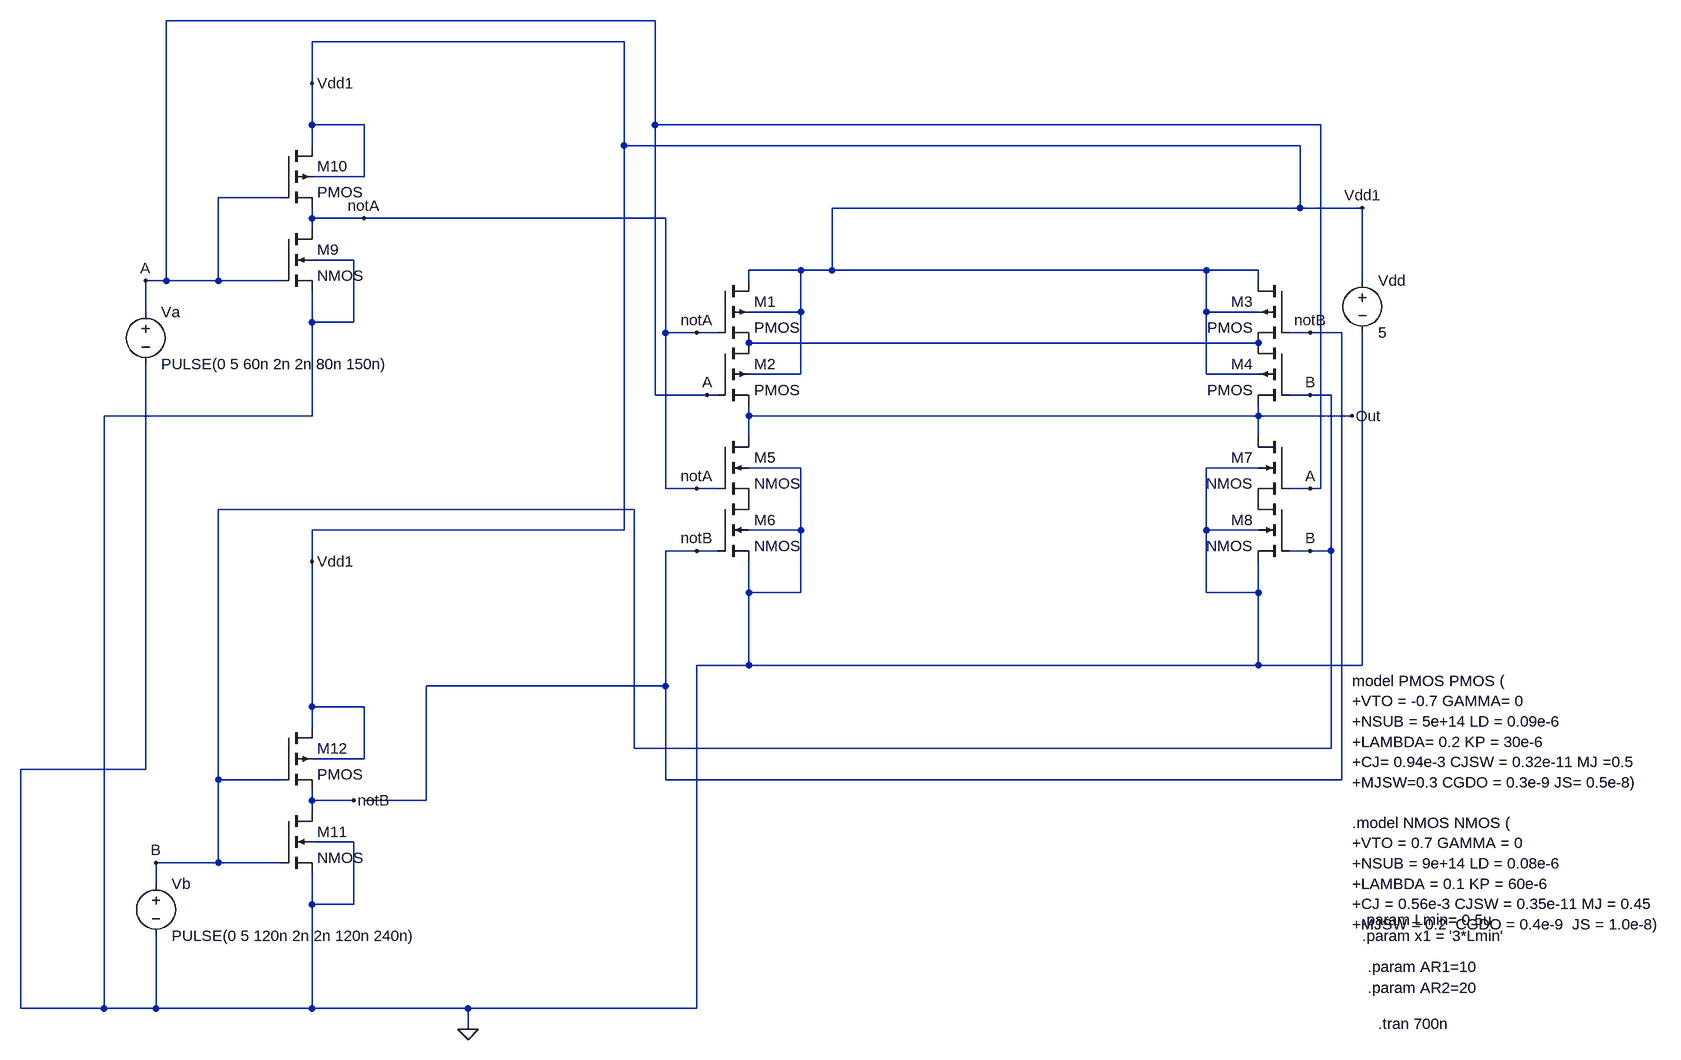
[diagram p0: schematic XOR.asc]
XOR.asc, the LTspice schematic file:
Version 4
SHEET 1 2156 1524
WIRE 576 -336 -176 -336
WIRE 528 -304 48 -304
WIRE 48 -240 48 -304
WIRE 48 -176 48 -240
WIRE 128 -176 48 -176
WIRE 576 -176 576 -336
WIRE 1600 -176 576 -176
WIRE 48 -144 48 -176
WIRE 528 -144 528 -304
WIRE 1568 -144 528 -144
WIRE 128 -96 128 -176
WIRE 128 -96 48 -96
WIRE 0 -64 -96 -64
WIRE 1568 -48 1568 -144
WIRE 1568 -48 848 -48
WIRE 1664 -48 1568 -48
WIRE 48 -32 48 -48
WIRE 128 -32 48 -32
WIRE 592 -32 128 -32
WIRE 48 -16 48 -32
WIRE 112 32 48 32
WIRE 800 48 720 48
WIRE 848 48 848 -48
WIRE 848 48 800 48
WIRE 1424 48 848 48
WIRE 1504 48 1424 48
WIRE -176 64 -176 -336
WIRE -176 64 -208 64
WIRE -96 64 -96 -64
WIRE -96 64 -176 64
WIRE 0 64 -96 64
WIRE 720 64 720 48
WIRE 1504 64 1504 48
WIRE 1664 64 1664 -48
WIRE -208 112 -208 64
WIRE 800 112 800 48
WIRE 800 112 720 112
WIRE 1424 112 1424 48
WIRE 1504 112 1424 112
WIRE 48 128 48 80
WIRE 112 128 112 32
WIRE 112 128 48 128
WIRE 592 144 592 -32
WIRE 640 144 592 144
WIRE 672 144 640 144
WIRE 1584 144 1552 144
WIRE 1632 144 1584 144
WIRE 1504 160 720 160
WIRE 800 208 800 112
WIRE 800 208 720 208
WIRE 1424 208 1424 112
WIRE 1504 208 1424 208
WIRE 576 240 576 -176
WIRE 656 240 576 240
WIRE 672 240 656 240
WIRE 1584 240 1552 240
WIRE 1616 240 1584 240
WIRE 48 272 48 128
WIRE 48 272 -272 272
WIRE 720 272 720 256
WIRE 1504 272 1504 256
WIRE 1504 272 720 272
WIRE 1648 272 1504 272
WIRE 720 304 720 272
WIRE 1504 304 1504 272
WIRE 800 352 720 352
WIRE 1504 352 1424 352
WIRE 592 384 592 144
WIRE 640 384 592 384
WIRE 672 384 640 384
WIRE 1584 384 1552 384
WIRE 1600 384 1600 -176
WIRE 1600 384 1584 384
WIRE 544 416 -96 416
WIRE 528 448 528 -144
WIRE 528 448 48 448
WIRE 800 448 800 352
WIRE 800 448 720 448
WIRE 1424 448 1424 352
WIRE 1504 448 1424 448
WIRE 640 480 592 480
WIRE 672 480 640 480
WIRE 1584 480 1552 480
WIRE 1616 480 1616 240
WIRE 1616 480 1584 480
WIRE 48 496 48 448
WIRE 720 544 720 496
WIRE 800 544 800 448
WIRE 800 544 720 544
WIRE 1424 544 1424 448
WIRE 1504 544 1504 496
WIRE 1504 544 1424 544
WIRE 720 656 720 544
WIRE 720 656 640 656
WIRE 1504 656 1504 544
WIRE 1504 656 720 656
WIRE 1664 656 1664 144
WIRE 1664 656 1504 656
WIRE 592 688 592 480
WIRE 592 688 224 688
WIRE 48 720 48 496
WIRE 128 720 48 720
WIRE 48 752 48 720
WIRE 544 784 544 416
WIRE 1616 784 1616 480
WIRE 1616 784 544 784
WIRE 128 800 128 720
WIRE 128 800 48 800
WIRE -208 816 -208 192
WIRE -208 816 -400 816
WIRE -96 832 -96 416
WIRE 0 832 -96 832
WIRE 592 832 592 688
WIRE 1632 832 1632 144
WIRE 1632 832 592 832
WIRE 48 864 48 848
WIRE 112 864 48 864
WIRE 224 864 224 688
WIRE 224 864 128 864
WIRE 48 880 48 864
WIRE 112 928 48 928
WIRE -96 960 -96 832
WIRE -96 960 -192 960
WIRE 0 960 -96 960
WIRE -192 992 -192 960
WIRE 48 1024 48 976
WIRE 112 1024 112 928
WIRE 112 1024 48 1024
WIRE -400 1184 -400 816
WIRE -272 1184 -272 272
WIRE -272 1184 -400 1184
WIRE -192 1184 -192 1072
WIRE -192 1184 -272 1184
WIRE 48 1184 48 1024
WIRE 48 1184 -192 1184
WIRE 288 1184 48 1184
WIRE 640 1184 640 656
WIRE 640 1184 288 1184
WIRE 288 1216 288 1184
FLAG 1648 272 Out
FLAG 128 -32 notA
FLAG 112 864 notB
FLAG -208 64 A
FLAG 656 240 A
FLAG 1584 144 notB
FLAG -192 960 B
FLAG 640 480 notB
FLAG 640 384 notA
FLAG 1584 384 A
FLAG 1584 480 B
FLAG 640 144 notA
FLAG 1584 240 B
FLAG 1664 -48 Vdd1
FLAG 48 -240 Vdd1
FLAG 48 496 Vdd1
FLAG 288 1216 0
SYMBOL pmos4 672 64 R0
SYMATTR InstName M1
SYMATTR Value2 l={Lmin} w={AR2*Lmin} ad={x1*AR2*Lmin} as={x1*AR2*Lmin} pd={2*x1 + 2*AR2*Lmin} ps={2*x1 + 2*AR2*Lmin}
SYMBOL pmos4 672 160 R0
SYMATTR InstName M2
SYMATTR Value2 l={Lmin} w={AR2*Lmin} ad={x1*AR2*Lmin} as={x1*AR2*Lmin} pd={2*x1 + 2*AR2*Lmin} ps={2*x1 + 2*AR2*Lmin}
SYMBOL pmos4 1552 64 M0
SYMATTR InstName M3
SYMATTR Value2 l={Lmin} w={AR2*Lmin} ad={x1*AR2*Lmin} as={x1*AR2*Lmin} pd={2*x1 + 2*AR2*Lmin} ps={2*x1 + 2*AR2*Lmin}
SYMBOL pmos4 1552 160 M0
SYMATTR InstName M4
SYMATTR Value2 l={Lmin} w={AR2*Lmin} ad={x1*AR2*Lmin} as={x1*AR2*Lmin} pd={2*x1 + 2*AR2*Lmin} ps={2*x1 + 2*AR2*Lmin}
SYMBOL voltage 1664 48 R0
SYMATTR InstName Vdd
SYMATTR Value 5
SYMBOL nmos4 672 304 R0
SYMATTR InstName M5
SYMATTR Value2 l={Lmin} w={AR1*Lmin} ad={x1*AR1*Lmin} as={x1*AR1*Lmin} pd={2*x1 + 2*AR1*Lmin} ps={2*x1 + 2*AR1*Lmin}
SYMBOL nmos4 672 400 R0
SYMATTR InstName M6
SYMATTR Value2 l={Lmin} w={AR1*Lmin} ad={x1*AR1*Lmin} as={x1*AR1*Lmin} pd={2*x1 + 2*AR1*Lmin} ps={2*x1 + 2*AR1*Lmin}
SYMBOL nmos4 1552 304 M0
SYMATTR InstName M7
SYMATTR Value2 l={Lmin} w={AR1*Lmin} ad={x1*AR1*Lmin} as={x1*AR1*Lmin} pd={2*x1 + 2*AR1*Lmin} ps={2*x1 + 2*AR1*Lmin}
SYMBOL nmos4 1552 400 M0
SYMATTR InstName M8
SYMATTR Value2 l={Lmin} w={AR1*Lmin} ad={x1*AR1*Lmin} as={x1*AR1*Lmin} pd={2*x1 + 2*AR1*Lmin} ps={2*x1 + 2*AR1*Lmin}
SYMBOL nmos4 0 -16 R0
SYMATTR InstName M9
SYMATTR Value2 l={Lmin} w={AR1*Lmin} ad={x1*AR1*Lmin} as={x1*AR1*Lmin} pd={2*x1 + 2*AR1*Lmin} ps={2*x1 + 2*AR1*Lmin}
SYMBOL pmos4 0 -144 R0
SYMATTR InstName M10
SYMATTR Value2 l={Lmin} w={AR2*Lmin} ad={x1*AR2*Lmin} as={x1*AR2*Lmin} pd={2*x1 + 2*AR2*Lmin} ps={2*x1 + 2*AR2*Lmin}
SYMBOL nmos4 0 880 R0
SYMATTR InstName M11
SYMATTR Value2 l={Lmin} w={AR1*Lmin} ad={x1*AR1*Lmin} as={x1*AR1*Lmin} pd={2*x1 + 2*AR1*Lmin} ps={2*x1 + 2*AR1*Lmin}
SYMBOL pmos4 0 752 R0
SYMATTR InstName M12
SYMATTR Value2 l={Lmin} w={AR2*Lmin} ad={x1*AR2*Lmin} as={x1*AR2*Lmin} pd={2*x1 + 2*AR2*Lmin} ps={2*x1 + 2*AR2*Lmin}
SYMBOL voltage -208 96 R0
SYMATTR InstName Va
SYMATTR Value PULSE(0 5 60n 2n 2n 80n 150n)
SYMBOL voltage -192 976 R0
SYMATTR InstName Vb
SYMATTR Value PULSE(0 5 120n 2n 2n 120n 240n)
TEXT 1648 680 Left 2 !model PMOS PMOS (\n+VTO = -0.7 GAMMA= 0 \n+NSUB = 5e+14 LD = 0.09e-6 \n+LAMBDA= 0.2 KP = 30e-6\n+CJ= 0.94e-3 CJSW = 0.32e-11 MJ =0.5 \n+MJSW=0.3 CGDO = 0.3e-9 JS= 0.5e-8)\n \n.model NMOS NMOS ( \n+VTO = 0.7 GAMMA = 0 \n+NSUB = 9e+14 LD = 0.08e-6 \n+LAMBDA = 0.1 KP = 60e-6 \n+CJ = 0.56e-3 CJSW = 0.35e-11 MJ = 0.45 \n+MJSW = 0.2  CGDO = 0.4e-9  JS = 1.0e-8)
TEXT 1664 1048 Left 2 !.param Lmin= 0.5u
TEXT 1664 1072 Left 2 !.param x1 = '3*Lmin'
TEXT 1672 1120 Left 2 !.param AR1=10
TEXT 1672 1152 Left 2 !.param AR2=20
TEXT 1688 1208 Left 2 !.tran 700n

The netlist it stands for:
* XOR.asc
M1 Vdd1 notA N001 Vdd1 PMOS l={Lmin} w={AR2*Lmin} ad={x1*AR2*Lmin} as={x1*AR2*Lmin} pd={2*x1 + 2*AR2*Lmin} ps={2*x1 + 2*AR2*Lmin}
M2 N001 A Out Vdd1 PMOS l={Lmin} w={AR2*Lmin} ad={x1*AR2*Lmin} as={x1*AR2*Lmin} pd={2*x1 + 2*AR2*Lmin} ps={2*x1 + 2*AR2*Lmin}
M3 Vdd1 notB N001 Vdd1 PMOS l={Lmin} w={AR2*Lmin} ad={x1*AR2*Lmin} as={x1*AR2*Lmin} pd={2*x1 + 2*AR2*Lmin} ps={2*x1 + 2*AR2*Lmin}
M4 N001 B Out Vdd1 PMOS l={Lmin} w={AR2*Lmin} ad={x1*AR2*Lmin} as={x1*AR2*Lmin} pd={2*x1 + 2*AR2*Lmin} ps={2*x1 + 2*AR2*Lmin}
Vdd Vdd1 0 5
M5 Out notA P001 0 NMOS l={Lmin} w={AR1*Lmin} ad={x1*AR1*Lmin} as={x1*AR1*Lmin} pd={2*x1 + 2*AR1*Lmin} ps={2*x1 + 2*AR1*Lmin}
M6 P001 notB 0 0 NMOS l={Lmin} w={AR1*Lmin} ad={x1*AR1*Lmin} as={x1*AR1*Lmin} pd={2*x1 + 2*AR1*Lmin} ps={2*x1 + 2*AR1*Lmin}
M7 Out A P002 0 NMOS l={Lmin} w={AR1*Lmin} ad={x1*AR1*Lmin} as={x1*AR1*Lmin} pd={2*x1 + 2*AR1*Lmin} ps={2*x1 + 2*AR1*Lmin}
M8 P002 B 0 0 NMOS l={Lmin} w={AR1*Lmin} ad={x1*AR1*Lmin} as={x1*AR1*Lmin} pd={2*x1 + 2*AR1*Lmin} ps={2*x1 + 2*AR1*Lmin}
M9 notA A 0 0 NMOS l={Lmin} w={AR1*Lmin} ad={x1*AR1*Lmin} as={x1*AR1*Lmin} pd={2*x1 + 2*AR1*Lmin} ps={2*x1 + 2*AR1*Lmin}
M10 Vdd1 A notA Vdd1 PMOS l={Lmin} w={AR2*Lmin} ad={x1*AR2*Lmin} as={x1*AR2*Lmin} pd={2*x1 + 2*AR2*Lmin} ps={2*x1 + 2*AR2*Lmin}
M11 notB B 0 0 NMOS l={Lmin} w={AR1*Lmin} ad={x1*AR1*Lmin} as={x1*AR1*Lmin} pd={2*x1 + 2*AR1*Lmin} ps={2*x1 + 2*AR1*Lmin}
M12 Vdd1 B notB Vdd1 PMOS l={Lmin} w={AR2*Lmin} ad={x1*AR2*Lmin} as={x1*AR2*Lmin} pd={2*x1 + 2*AR2*Lmin} ps={2*x1 + 2*AR2*Lmin}
Va A 0 PULSE(0 5 60n 2n 2n 80n 150n)
Vb B 0 PULSE(0 5 120n 2n 2n 120n 240n)
.model NMOS NMOS
.model PMOS PMOS
.lib standard.mos
model PMOS PMOS (
+VTO = -0.7 GAMMA= 0
+NSUB = 5e+14 LD = 0.09e-6
+LAMBDA= 0.2 KP = 30e-6
+CJ= 0.94e-3 CJSW = 0.32e-11 MJ =0.5
+MJSW=0.3 CGDO = 0.3e-9 JS= 0.5e-8)
.model NMOS NMOS (
+VTO = 0.7 GAMMA = 0
+NSUB = 9e+14 LD = 0.08e-6
+LAMBDA = 0.1 KP = 60e-6
+CJ = 0.56e-3 CJSW = 0.35e-11 MJ = 0.45
+MJSW = 0.2  CGDO = 0.4e-9  JS = 1.0e-8)
.param Lmin= 0.5u
.param x1 = '3*Lmin'
.param AR1=10
.param AR2=20
.tran 700n
.backanno
.end